# Altium schematic sheet 智能家居-电灯-电力板.SchDoc
size A4
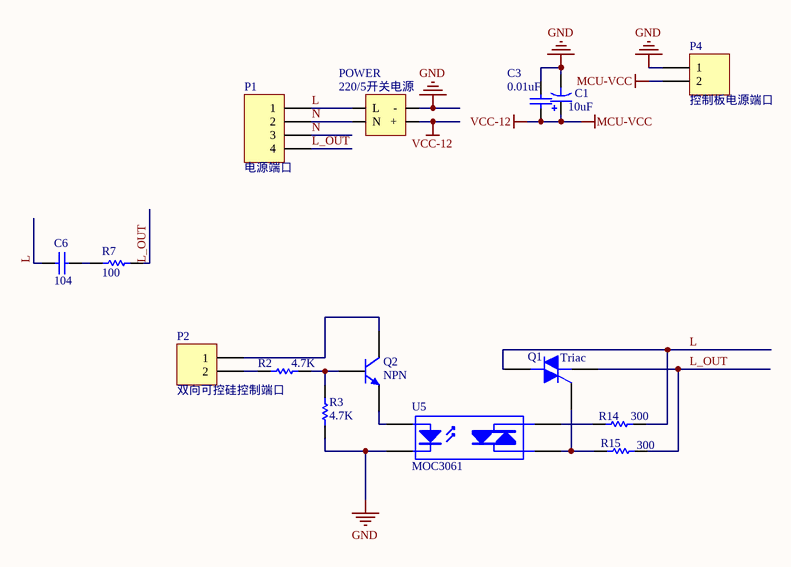
[diagram p0: 智能家居-电灯-电力板.SchDoc]

## Parts
C1  value 10uF  [CD5]  (hidden comment: Cap Pol1)
C3  0.01uF  [0.1UF]
C6  value 104  [0.1UF/275V]  (hidden comment: Cap)
P1  电源端口  [JK128-500-4P]
P2  双向可控硅控制端口  [TJC3-2A]
P4  控制板电源端口  [TJC3-2A]
POWER  220/5开关电源  [220/5开关电源]
Q1  Triac  [TO-220(2)]
Q2  NPN  [TO-92D]
R2  4.7K  [AXIAL0.3]
R3  4.7K  [AXIAL0.3]
R7  100  [AXIAL0.3]
R14  300  [AXIAL0.3]
R15  300  [AXIAL0.3]
U5  MOC3061  [DIP-6N]

## Nets
GND: C1.2 C3.2 P4.1 POWER.3(-) R3.2 U5.2
MCU-VCC: C1.1 C3.1 P4.2 POWER.4(+)  [also labelled VCC-12]
L: C6.2 P1.1 POWER.1(L) Q1.2(M2) R14.1
L_OUT: P1.4 Q1.1(M1) R7.1 R15.1
N: P1.2 P1.3 POWER.2(N)
NetC6_1: C6.1 R7.2
NetP2_1: P2.1 Q2.3(C)
NetP2_2: P2.2 R2.1
NetQ1_3: Q1.3(G) R15.2 U5.4(A/K)
NetQ2_1: Q2.1(E) U5.1
NetQ2_2: Q2.2(B) R2.2 R3.1
NetR14_2: R14.2 U5.6

## Library data of the parts
C1 = Cap Pol1: Polarized Capacitor (Radial); Published: 8-Jun-2000; LatestRevisionDate: 17-Jul-2002; LatestRevisionNote: Re-released for DXP Platform.; PackageReference: RB7.6-15; Publisher: Altium Limited; PackageDescription: Polarized Capacitor (Radial); 2 Leads
C3 C6 = Cap: Capacitor; Published: 8-Jun-2000; LatestRevisionDate: 17-Jul-2002; LatestRevisionNote: Re-released for DXP Platform.; Publisher: Altium Limited; PackageDescription: Radial Cap, Thru-Hole; 2 Leads; 0.3 in Pin Spacing
  C3: PackageReference: 0.1UF; Value: 0.01uF
  C6: PackageReference: RAD-0.3
P1 = Header 4: Header, 4-Pin; LatestRevisionDate: 17-Jul-2002; LatestRevisionNote: Re-released for DXP Platform.; Publisher: Altium Limited
P2 P4 = Header 2: Header, 2-Pin; LatestRevisionDate: 17-Jul-2002; LatestRevisionNote: Re-released for DXP Platform.; Publisher: Altium Limited
Q1 = Triac: Silicon Bidirectional Triode Thyristor; Note: Pin 2 is electrically connected to Pin 4 (TAB); Published: 29-Sep-2000; LatestRevisionDate: 17-Jul-2002; LatestRevisionNote: Re-released for DXP Platform.; DatasheetVersion: 1999; PackageReference: 369-03; Publisher: Altium Limited; PackageDescription: TO, Thru-Hole, Vertical, Heatsink Mounted; 3 In-Line Leads; Pitch 2.28 mm; ComponentLink1Description: Manufacturer Link; ComponentLink1URL: http://www.motorola.com/
Q2 = NPN: NPN Bipolar Transistor; Published: 8-Jun-2000; LatestRevisionDate: 17-Jul-2002; LatestRevisionNote: Re-released for DXP Platform.; PackageReference: TO-226-AA; Publisher: Altium Limited; PackageDescription: TO, Flat Index; 3 In-Line, Axial Leads; Body Dia. 4.8mm; Leads 0.55 x 0.51 mm (max); Code_JEDEC: TO-226-AA
R2 R3 R7 R14 R15 = Res1: Resistor; Value: 1K; Published: 8-Jun-2000; Revision: July-2002: Re-released for DXP Platform.; Publisher: Altium Limited
U5 = OPTOTRIAC